# EAGLE schematic TILDO (EAGLE 7.1.0)
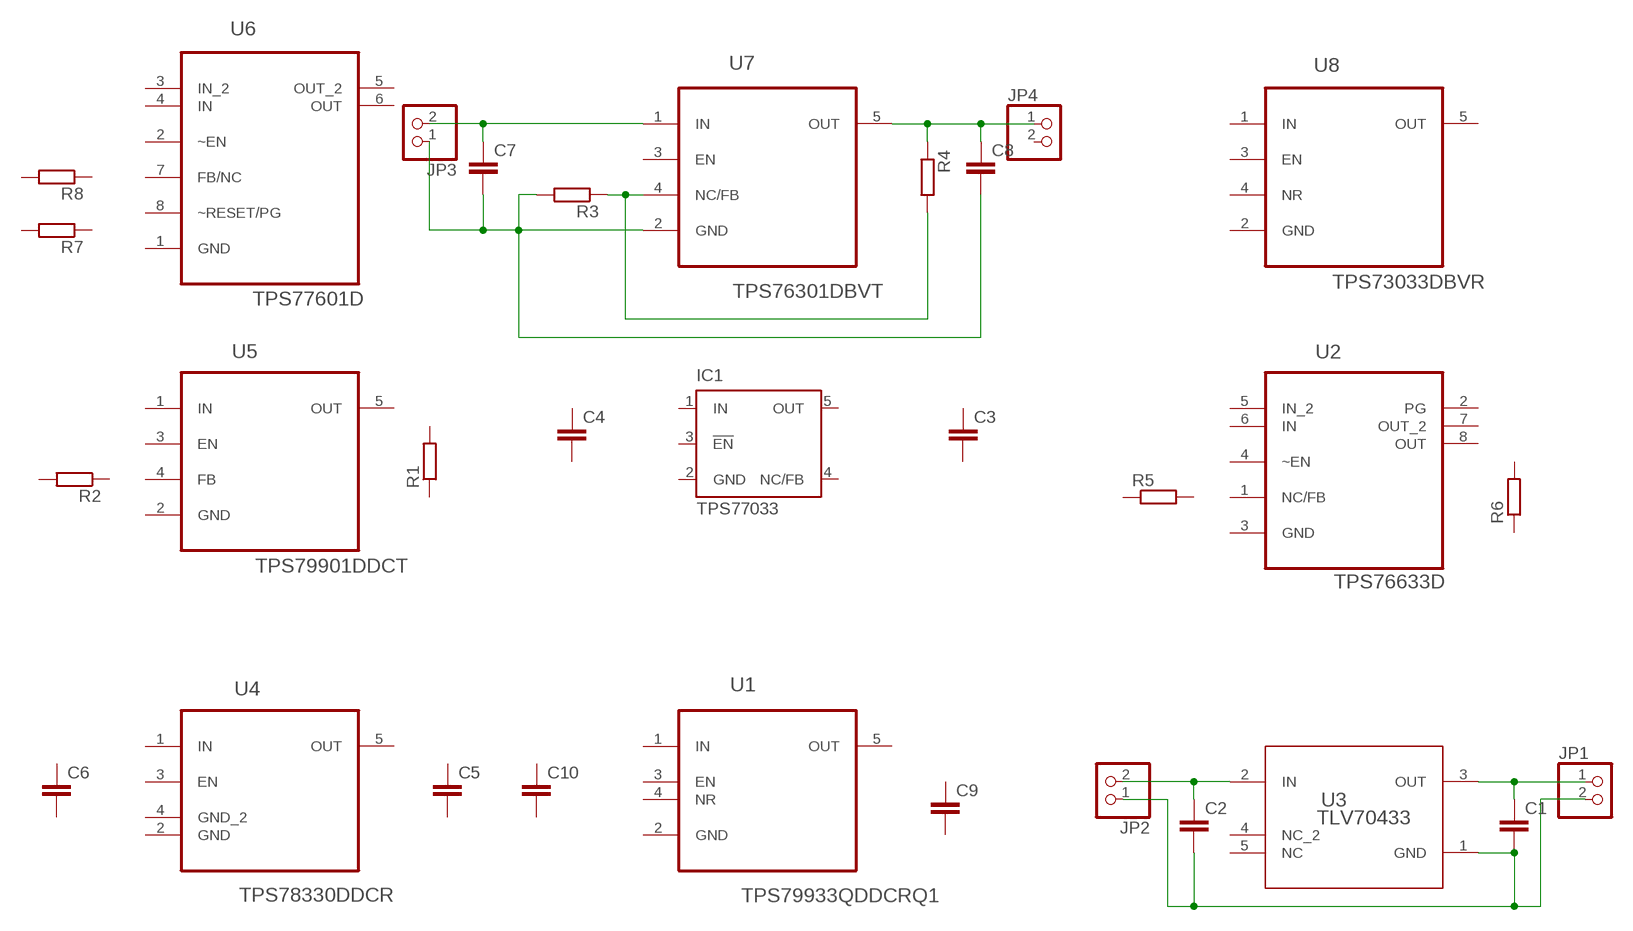
[diagram p0: schematic, sheet 1]

## Parts
C1  C-EUC1206  [C1206]
C2  C-EUC1206  [C1206]
C3  C-EUC1206  [C1206]
C4  C-EUC1206  [C1206]
C5  C-EUC0805  [C0805]
C6  C-EUC0805  [C0805]
C7  C-EUC0805  [C0805]
C8  C-EUC0805  [C0805]
C9  C-EUC1206  [C1206]
C10  C-EUC1206  [C1206]
IC1  TPS77033  [SOT23-DBV]
JP1  PINHD-1X2  [1X02]
JP2  PINHD-1X2  [1X02]
JP3  PINHD-1X2  [1X02]
JP4  PINHD-1X2  [1X02]
R1  R-EU_R0805  [R0805]
R2  R-EU_R0805  [R0805]
R3  R-EU_R0805  [R0805]
R4  R-EU_R0805  [R0805]
R5  R-EU_R0805  [R0805]
R6  R-EU_R0805  [R0805]
R7  R-EU_R0805  [R0805]
R8  R-EU_R0805  [R0805]
U1  TPS79933QDDCRQ1  [SOT95P280X110-5N]
U2  TPS76633D  [SOIC127P600X175-8N]
U3  TLV70433  TLV70430DBVR  [DBV0005A_N]
U4  TPS78330DDCR  [SOT95P280X110-5N]
U5  TPS79901DDCT  [SOT95P280X110-5N]
U6  TPS77601D  [SOIC127P600X175-8N]
U7  TPS76301DBVT  [SOT95P280X145-5N]
U8  TPS73033DBVR  [SOT95P280X145-5N]

## Nets
GND: C1.2 C2.2 JP1.2 JP2.1 U3.1(GND)
N$1: C2.1 JP2.2 U3.2(IN)
N$2: R3.1 R4.2 U7.4(NC/FB)
N$3: C1.1 JP1.1 U3.3(OUT)
N$4: C8.1 JP4.1 R4.1 U7.5(OUT)
N$5: C7.1 JP3.2 U7.1(IN)
N$7: C7.2 C8.2 JP3.1 R3.2 U7.2(GND)
Unconnected: C3.1 C3.2 C4.1 C4.2 C5.1 C5.2 C6.1 C6.2 C9.1 C9.2 C10.1 C10.2 IC1.1(IN) IC1.3(!EN) IC1.4(NC/FB) IC1.5(OUT) JP4.2 R1.1 R1.2 R2.1 R2.2 R5.1 R5.2 R6.1 R6.2 R7.1 R7.2 R8.1 R8.2 U1.2(GND) U1.3(EN) U1.4(NR) U1.5(OUT) U2.1(NC/FB) U2.2(PG) U2.3(GND) U2.4(~EN) U2.5(IN_2) U2.6(IN) U2.7(OUT_2) U2.8(OUT) U3.4(NC_2) U3.5(NC) U4.1(IN) U4.2(GND) U4.3(EN) U4.4(GND_2) U4.5(OUT) U5.2(GND) U5.3(EN) U5.4(FB) U5.5(OUT) U6.1(GND) U6.2(~EN) U6.3(IN_2) U6.4(IN) U6.5(OUT_2) U6.6(OUT) U6.7(FB/NC) U6.8(~RESET/PG) U7.3(EN) U8.2(GND) U8.3(EN) U8.4(NR) U8.5(OUT)

## Power pins joined to a net without a drawn wire
GND: IC1.2(GND)
IN: U1.1(IN) U5.1(IN) U8.1(IN)

## Library data of the parts
C1-C10 = rcl:C-EU: CAPACITOR, European symbol
IC1 = texas:TPS770*: ULTRALOW-POWER 50-mA LOW-DROPOUT LINEAR REGULATORS 50-mA Low-Dropout Regulator Source: http://focus.ti.com/lit/ds/symlink/tps77001.pdf; MF: TEXAS INSTRUMENTS; MPN: TPS77033DBVT; OC_FARNELL: 8461570; OC_NEWARK: 77C1187
JP1-JP4 = pinhead:PINHD-1X2: PIN HEADER
R1-R8 = rcl:R-EU_: RESISTOR, European symbol
U1 = Texas Instruments_By_element14_Batch_1:TPS79933QDDCRQ1: LINEAR REGULATOR; MPN: TPS79933QDDCRQ1; OC_FARNELL: -; OC_NEWARK: 25R0151; PACKAGE: SOT-5; SUPPLIER: Texas Instruments
U2 = Texas Instruments_By_element14_Batch_1:TPS76633D: ULTRALOW QUIESCENT CURRENT 250-mA LOW DROPOUT VOLTAGE REGULATORS; MPN: TPS76633D; OC_FARNELL: 8461422; OC_NEWARK: 77C1060; PACKAGE: SOIC-8; SUPPLIER: Texas Instruments
U3 = si5351:TLV70430DBVR; MANUFACTURER: Texas Instruments; PARTNUMBER: TLV70430DBVR; REFDES: RefDes; TYPE: TYPE; VALUE: Value
U4 = Texas Instruments_By_element14_Batch_1:TPS78330DDCR: 500nA IQ, 150mA, Ultra-Low Quiescent Current Low-Dropout Linear Regulator; MPN: TPS78330DDCR; OC_FARNELL: -; OC_NEWARK: 72R6681; PACKAGE: SOT-5; SUPPLIER: Texas Instruments
U5 = Texas Instruments_By_element14_Batch_1:TPS79901DDCT: 200mA, Low Quiescent Current, Ultra-Low Noise, High PSRR Low Dropout Linear Regulator; MPN: TPS79901DDCT; OC_FARNELL: 1135396; OC_NEWARK: 08K4978; PACKAGE: SOT-23-5; SUPPLIER: Texas Instruments
U6 = Texas Instruments_By_element14_Batch_1:TPS77601D: LINEAR REGULATORS; MPN: TPS77601D; OC_FARNELL: 4513411; OC_NEWARK: 19C9100; PACKAGE: SOIC-8; SUPPLIER: Texas Instruments
U7 = Texas Instruments_By_element14_Batch_1:TPS76301DBVT: Low power 150mA Low Dropout Linear Regulators; MPN: TPS76301DBVT; OC_FARNELL: 8461325; OC_NEWARK: 35K1346; PACKAGE: SOT-23-5; SUPPLIER: Texas Instruments
U8 = Texas Instruments_By_element14_Batch_1:TPS73033DBVR: LOW-NOISE, HIGH PSRR, RF 200-mA LOW-DROPOUT LINEAR REGULATORS; MPN: TPS73033DBVR; OC_FARNELL: 1696330; OC_NEWARK: 71J8232; PACKAGE: SOT-23-5; SUPPLIER: Texas Instruments